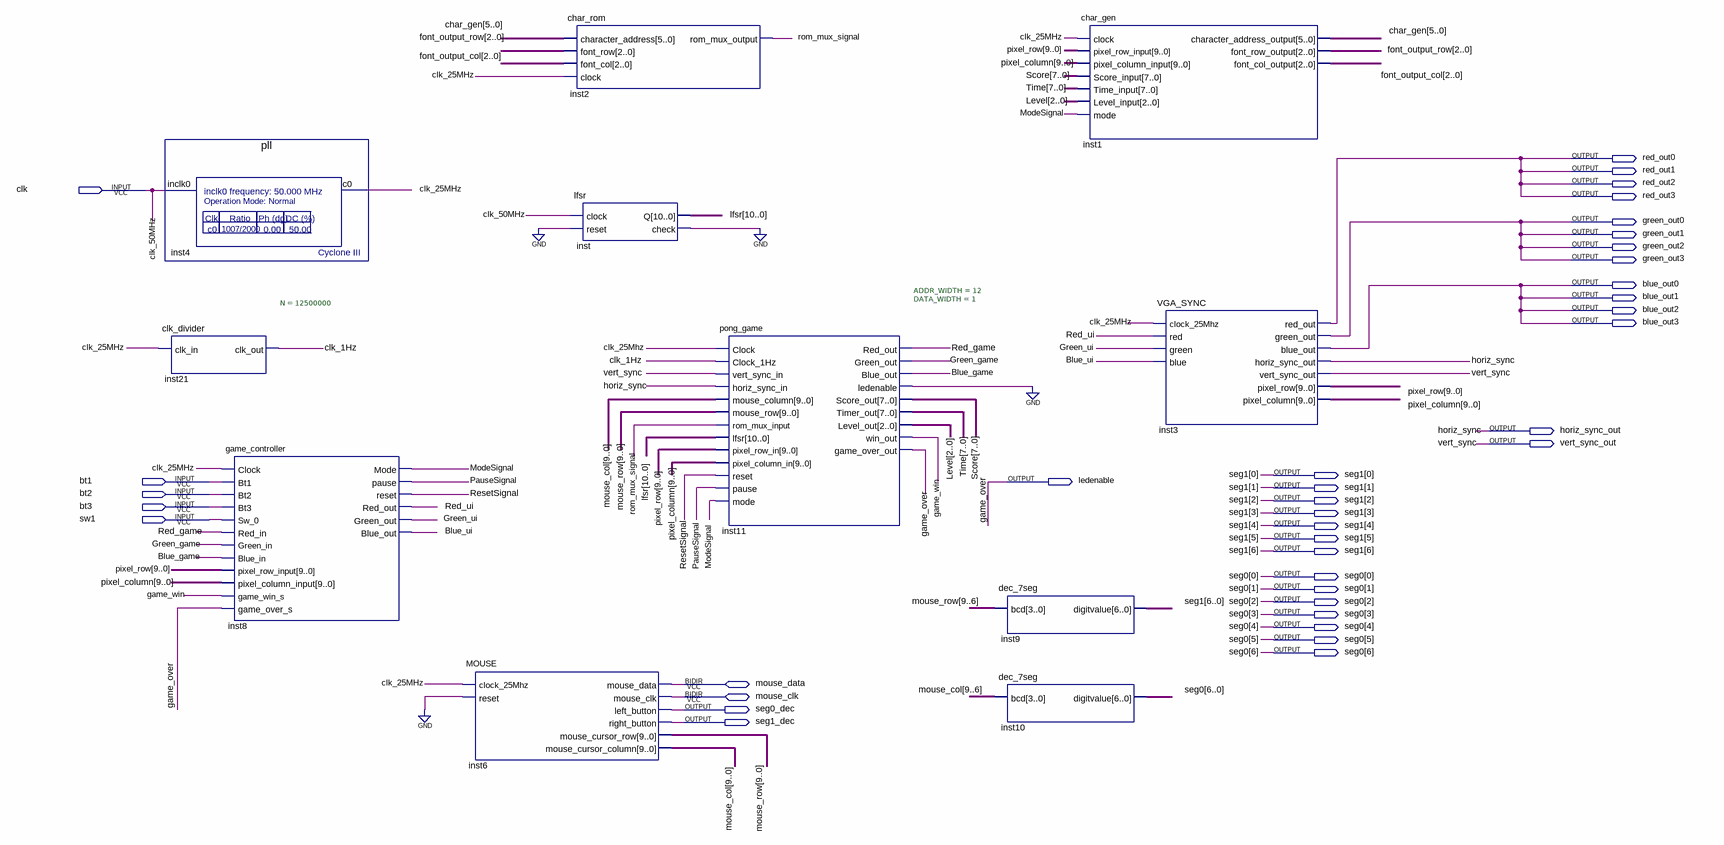
[diagram p0: schematic sheet]
// Quartus schematic Miniproject22.bdf as structural Verilog: 11 symbols, 38 pins
module Miniproject22 (
  input  clk,
  input  bt1,
  input  bt2,
  input  bt3,
  input  sw1,
  inout  mouse_data,
  inout  mouse_clk,
  output red_out0,
  output red_out1,
  output red_out2,
  output red_out3,
  output green_out0,
  output green_out1,
  output green_out2,
  output green_out3,
  output blue_out0,
  output blue_out1,
  output blue_out2,
  output blue_out3,
  output horiz_sync_out,
  output vert_sync_out,
  output [6:0] seg1,
  output ledenable,
  output [6:0] seg0,
  output seg0_dec,
  output seg1_dec
);

  wire Blue_game, Blue_ui, clk_1Hz, clk_25MHz, game_win, Green_game, Green_ui, inst11_ledenable, inst_check,
       ModeSignal, PauseSignal, Red_game, Red_ui, ResetSignal, rom_mux_signal;
  wire [2:0] font_output_col, font_output_row, Level;
  wire [5:0] char_gen;
  wire [7:0] Score, Time;
  wire [9:0] mouse_col, mouse_row, pixel_column, pixel_row;
  wire [10:0] lfsr;

  pll inst4 (.inclk0(clk), .c0(clk_25MHz));
  clk_divider #(.N(12500000)) inst21 (.clk_in(clk_25MHz), .clk_out(clk_1Hz));
  game_controller inst8 (
    .Clock(clk_25MHz), .Bt1(bt1), .Bt2(bt2), .Bt3(bt3), .Sw_0(sw1), .Red_in(Red_game), .Green_in(Green_game),
    .Blue_in(Blue_game), .pixel_row_input(pixel_row), .pixel_column_input(pixel_column),
    .game_win_s(game_win), .game_over_s(ledenable), .Mode(ModeSignal), .pause(PauseSignal),
    .reset(ResetSignal), .Red_out(Red_ui), .Green_out(Green_ui), .Blue_out(Blue_ui));
  MOUSE inst6 (
    .clock_25Mhz(clk_25MHz), .reset(1'b0), .left_button(seg0_dec), .right_button(seg1_dec),
    .mouse_cursor_row(mouse_row), .mouse_cursor_column(mouse_col), .mouse_data(mouse_data),
    .mouse_clk(mouse_clk));
  char_rom inst2 (
    .character_address(char_gen), .font_row(font_output_row), .font_col(font_output_col), .clock(clk_25MHz),
    .rom_mux_output(rom_mux_signal));
  lfsr inst (.clock(clk), .reset(1'b0), .Q(lfsr), .check(inst_check));
  pong_game #(.ADDR_WIDTH(12), .DATA_WIDTH(1)) inst11 (
    .Clock(clk_25MHz), .Clock_1Hz(clk_1Hz), .vert_sync_in(vert_sync_out), .horiz_sync_in(horiz_sync_out),
    .mouse_column(mouse_col), .mouse_row(mouse_row), .rom_mux_input(rom_mux_signal), .lfsr(lfsr),
    .pixel_row_in(pixel_row), .pixel_column_in(pixel_column), .reset(ResetSignal), .pause(PauseSignal),
    .mode(ModeSignal), .Red_out(Red_game), .Green_out(Green_game), .Blue_out(Blue_game),
    .ledenable(inst11_ledenable), .Score_out(Score), .Timer_out(Time), .Level_out(Level), .win_out(game_win),
    .game_over_out(ledenable));
  dec_7seg inst9 (.bcd(mouse_row[9:6]), .digitvalue(seg1));
  dec_7seg inst10 (.bcd(mouse_col[9:6]), .digitvalue(seg0));
  char_gen inst1 (
    .clock(clk_25MHz), .pixel_row_input(pixel_row), .pixel_column_input(pixel_column), .Score_input(Score),
    .Time_input(Time), .Level_input(Level), .mode(ModeSignal), .character_address_output(char_gen),
    .font_row_output(font_output_row), .font_col_output(font_output_col));
  VGA_SYNC inst3 (
    .clock_25Mhz(clk_25MHz), .red(Red_ui), .green(Green_ui), .blue(Blue_ui), .red_out(red_out0),
    .green_out(green_out0), .blue_out(blue_out0), .horiz_sync_out(horiz_sync_out),
    .vert_sync_out(vert_sync_out), .pixel_row(pixel_row), .pixel_column(pixel_column));

  assign blue_out1 = blue_out0;
  assign blue_out2 = blue_out0;
  assign blue_out3 = blue_out0;
  assign green_out1 = green_out0;
  assign green_out2 = green_out0;
  assign green_out3 = green_out0;
  assign red_out1 = red_out0;
  assign red_out2 = red_out0;
  assign red_out3 = red_out0;
  // also tied to GND on the sheet: {inst11_ledenable, inst_check}

  // Other names for the same wires on the sheet: clk_50MHz = clk; horiz_sync = horiz_sync_out; game_over = ledenable;
  //   vert_sync = vert_sync_out
endmodule
